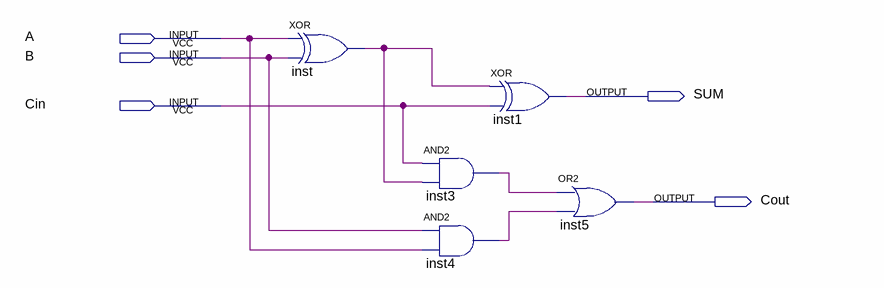
[diagram p0: schematic sheet]
// Quartus schematic FA.bdf as structural Verilog: 5 symbols, 5 pins
module FA (
  input  A,
  input  B,
  input  Cin,
  output SUM,
  output Cout
);

  wire inst3_out, inst4_out, inst_out;

  xor inst (inst_out, A, B);
  and inst3 (inst3_out, Cin, inst_out);
  and inst4 (inst4_out, B, A);
  xor inst1 (SUM, inst_out, Cin);
  or inst5 (Cout, inst3_out, inst4_out);
endmodule
